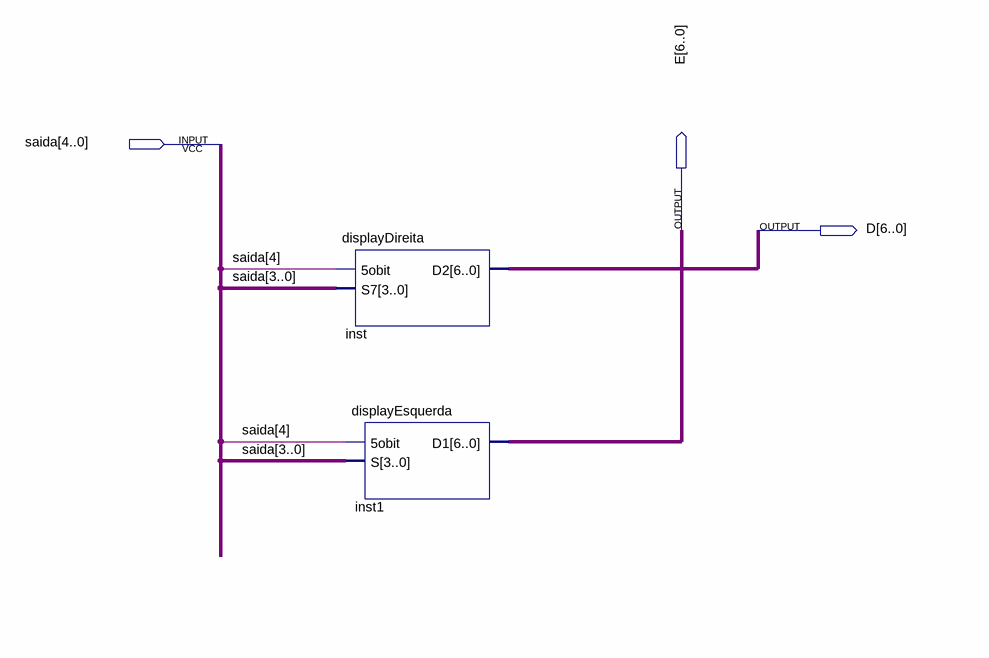
[diagram p0: schematic sheet]
// Quartus schematic LASTone.bdf as structural Verilog: 2 symbols, 3 pins
module LASTone (
  input  [4:0] saida,
  output [6:0] E,
  output [6:0] D
);

  displayDireita inst (.\5obit (saida[4]), .S7(saida[3:0]), .D2(D));
  displayEsquerda inst1 (.\5obit (saida[4]), .S(saida[3:0]), .D1(E));
endmodule
